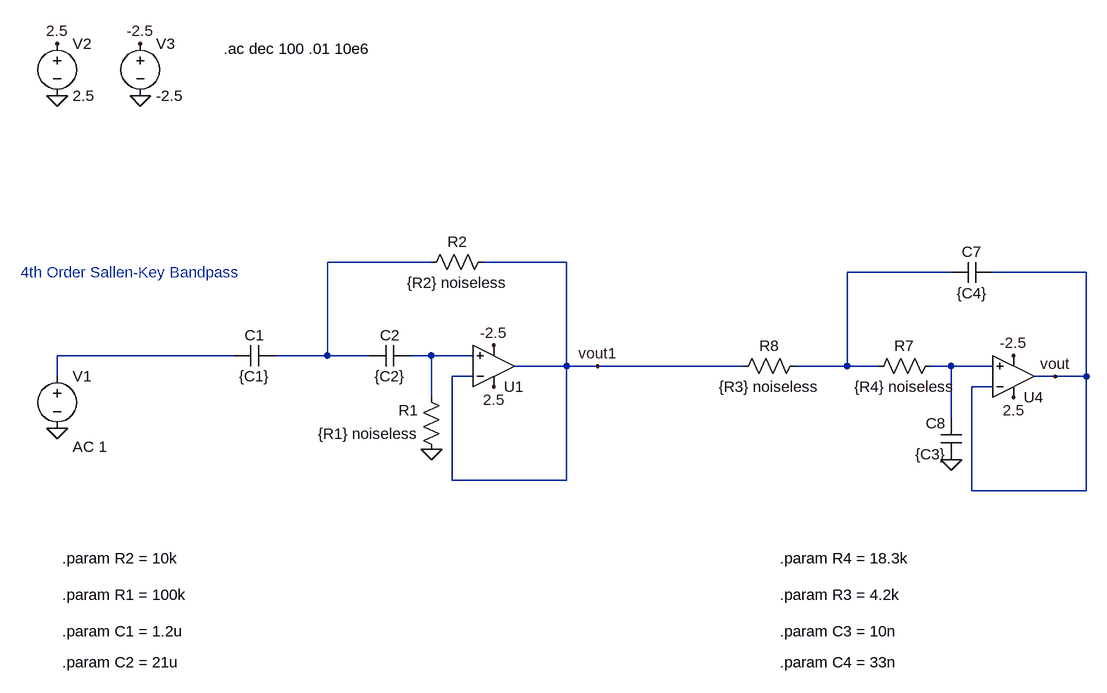
[diagram p0: schematic sallen_key_4th_order_BP.asc]
sallen_key_4th_order_BP.asc, the LTspice schematic file:
Version 4
SHEET 1 3356 856
WIRE 464 0 304 0
WIRE 672 0 544 0
WIRE 1264 16 1104 16
WIRE 1472 16 1328 16
WIRE 160 144 -112 144
WIRE 304 144 304 0
WIRE 304 144 224 144
WIRE 368 144 304 144
WIRE 464 144 432 144
WIRE 528 144 464 144
WIRE 672 160 672 0
WIRE 672 160 592 160
WIRE 720 160 672 160
WIRE 944 160 720 160
WIRE 1104 160 1104 16
WIRE 1104 160 1024 160
WIRE 1152 160 1104 160
WIRE 1264 160 1232 160
WIRE 1328 160 1264 160
WIRE -112 176 -112 144
WIRE 528 176 496 176
WIRE 1424 176 1392 176
WIRE 1472 176 1472 16
WIRE 1472 176 1424 176
WIRE 1328 192 1296 192
WIRE 464 208 464 144
WIRE 1264 240 1264 160
WIRE 496 336 496 176
WIRE 672 336 672 160
WIRE 672 336 496 336
WIRE 1296 352 1296 192
WIRE 1472 352 1472 176
WIRE 1472 352 1296 352
FLAG 560 192 2.5
FLAG 560 128 -2.5
FLAG 464 288 0
FLAG -112 256 0
FLAG -112 -336 2.5
FLAG 16 -336 -2.5
FLAG -112 -256 0
FLAG 16 -256 0
FLAG 720 160 vout1
FLAG 1360 208 2.5
FLAG 1360 144 -2.5
FLAG 1264 304 0
FLAG 1424 176 vout
SYMBOL Opamps\\UniversalOpamp2 560 160 M180
SYMATTR InstName U1
SYMATTR Value2 Avol=10Meg GBW=10Meg Slew=10Meg
SYMBOL res 448 16 R270
WINDOW 0 32 56 VTop 2
WINDOW 3 0 56 VBottom 2
SYMATTR InstName R2
SYMATTR Value {R2} noiseless
SYMBOL res 480 304 R180
WINDOW 0 36 76 Left 2
WINDOW 3 36 40 Left 2
SYMATTR InstName R1
SYMATTR Value {R1} noiseless
SYMBOL cap 432 128 R90
WINDOW 0 0 32 VBottom 2
WINDOW 3 32 32 VTop 2
SYMATTR InstName C2
SYMATTR Value {C2}
SYMBOL cap 160 160 R270
WINDOW 0 32 32 VTop 2
WINDOW 3 0 32 VBottom 2
SYMATTR InstName C1
SYMATTR Value {C1}
SYMBOL voltage -112 160 R0
WINDOW 123 24 124 Left 2
WINDOW 39 0 0 Left 0
WINDOW 3 24 44 Left 2
SYMATTR Value2 AC 1
SYMATTR Value ""
SYMATTR InstName V1
SYMBOL voltage -112 -352 R0
WINDOW 123 0 0 Left 0
WINDOW 39 0 0 Left 0
SYMATTR InstName V2
SYMATTR Value 2.5
SYMBOL voltage 16 -352 R0
WINDOW 123 0 0 Left 0
WINDOW 39 0 0 Left 0
SYMATTR InstName V3
SYMATTR Value -2.5
SYMBOL Opamps\\UniversalOpamp2 1360 176 M180
SYMATTR InstName U4
SYMATTR Value2 Avol=10Meg GBW=10Meg Slew=10Meg
SYMBOL res 1248 144 R90
WINDOW 0 0 56 VBottom 2
WINDOW 3 32 56 VTop 2
SYMATTR InstName R7
SYMATTR Value {R4} noiseless
SYMBOL res 1040 144 R90
WINDOW 0 0 56 VBottom 2
WINDOW 3 32 56 VTop 2
SYMATTR InstName R8
SYMATTR Value {R3} noiseless
SYMBOL cap 1328 0 R90
WINDOW 0 0 32 VBottom 2
WINDOW 3 32 32 VTop 2
SYMATTR InstName C7
SYMATTR Value {C4}
SYMBOL cap 1280 304 R180
WINDOW 0 24 56 Left 2
WINDOW 3 24 8 Left 2
SYMATTR InstName C8
SYMATTR Value {C3}
TEXT -168 16 Left 2 ;4th Order Sallen-Key Bandpass
TEXT 144 -328 Left 2 !.ac dec 100 .01 10e6
TEXT -104 456 Left 2 !.param R2 = 10k
TEXT -104 568 Left 2 !.param C1 = 1.2u
TEXT -104 616 Left 2 !.param C2 = 21u
TEXT -104 512 Left 2 !.param R1 = 100k
TEXT 1000 456 Left 2 !.param R4 = 18.3k
TEXT 1000 568 Left 2 !.param C3 = 10n
TEXT 1000 616 Left 2 !.param C4 = 33n
TEXT 1000 512 Left 2 !.param R3 = 4.2k

The netlist it stands for:
* sallen_key_4th_order_BP.asc
XU1 N004 vout1 2.5 -2.5 vout1 level.2 Avol=10Meg GBW=10Meg Slew=10Meg ilimit=25m rail=0 Vos=0 phimargin=45 en=0 enk=0 in=0 ink=0 Rin=500Meg  ; pins IN+ IN- V+ V- OUT
R2 N001 vout1 {R2} noiseless
R1 0 N004 {R1} noiseless
C2 N004 N001 {C2}
C1 N003 N001 {C1}
V1 N003 0 AC 1
V2 2.5 0 2.5
V3 -2.5 0 -2.5
XU4 N005 vout 2.5 -2.5 vout level.2 Avol=10Meg GBW=10Meg Slew=10Meg ilimit=25m rail=0 Vos=0 phimargin=45 en=0 enk=0 in=0 ink=0 Rin=500Meg  ; pins IN+ IN- V+ V- OUT
R7 N005 N002 {R4} noiseless
R8 N002 vout1 {R3} noiseless
C7 vout N002 {C4}
C8 0 N005 {C3}
* 4th Order Sallen-Key Bandpass
.ac dec 100 .01 10e6
.param R2 = 10k
.param C1 = 1.2u
.param C2 = 21u
.param R1 = 100k
.param R4 = 18.3k
.param C3 = 10n
.param C4 = 33n
.param R3 = 4.2k
.lib UniversalOpamps2.sub
.backanno
.end